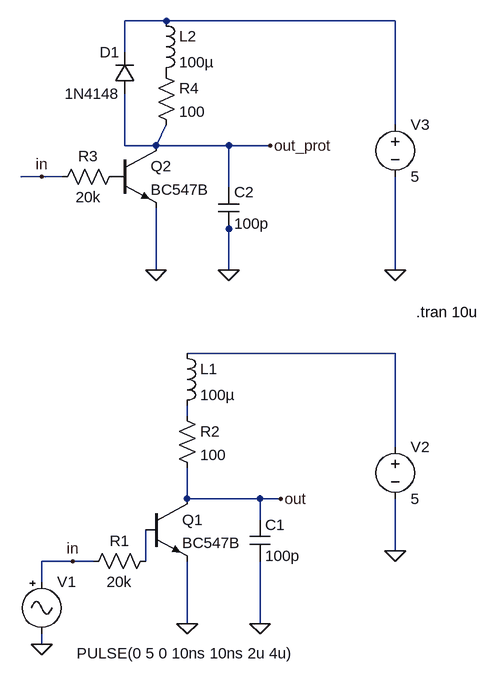
[diagram p0: schematic 3.10.asc]
3.10.asc, the LTspice schematic file:
Version 4
SHEET 1 880 1112
WIRE -128 -32 -192 -32
WIRE 224 -32 -128 -32
WIRE -192 16 -192 -32
WIRE 224 128 224 -32
WIRE -192 160 -192 80
WIRE -144 160 -128 128
WIRE -144 160 -192 160
WIRE -32 160 -144 160
WIRE 32 160 -32 160
WIRE -320 208 -352 208
WIRE -288 208 -320 208
WIRE -32 224 -32 160
WIRE -32 288 -32 272
WIRE -144 352 -144 256
WIRE -128 352 -144 352
WIRE -32 352 -32 288
WIRE 224 352 224 208
WIRE 224 480 -96 480
WIRE -96 576 -96 560
WIRE 224 624 224 480
WIRE -96 704 -96 656
WIRE 16 704 -96 704
WIRE 48 704 16 704
WIRE 16 736 16 704
WIRE 224 784 224 704
WIRE -272 800 -320 800
WIRE -240 800 -272 800
WIRE -160 800 -160 752
WIRE -320 832 -320 800
WIRE -96 896 -96 800
WIRE 16 896 16 800
WIRE -320 928 -320 912
FLAG -144 352 0
FLAG -32 352 0
FLAG 224 352 0
FLAG -320 208 in
FLAG 32 160 out_prot
FLAG -320 928 0
FLAG -96 896 0
FLAG 16 896 0
FLAG 224 784 0
FLAG -272 800 in
FLAG 48 704 out
SYMBOL res -192 192 R90
WINDOW 0 0 56 VBottom 2
WINDOW 3 32 56 VTop 2
SYMATTR InstName R3
SYMATTR Value 20k
SYMBOL res -144 32 R0
SYMATTR InstName R4
SYMATTR Value 100
SYMBOL voltage 224 112 R0
WINDOW 123 0 0 Left 2
WINDOW 39 0 0 Left 2
SYMATTR InstName V3
SYMATTR Value 5
SYMBOL cap -48 224 R0
SYMATTR InstName C2
SYMATTR Value 100p
SYMBOL npn -208 160 R0
SYMATTR InstName Q2
SYMATTR Value BC547B
SYMBOL ind -144 -48 R0
SYMATTR InstName L2
SYMATTR Value 100µ
SYMBOL diode -176 80 R180
WINDOW 0 24 64 Left 2
WINDOW 3 24 0 Left 2
SYMATTR InstName D1
SYMATTR Value 1N4148
SYMBOL Misc\\signal -320 816 R0
WINDOW 123 0 0 Left 2
WINDOW 39 0 0 Left 2
WINDOW 3 54 126 Left 2
SYMATTR InstName V1
SYMATTR Value PULSE(0 5 0 10ns 10ns 2u 4u)
SYMBOL res -144 784 R90
WINDOW 0 0 56 VBottom 2
WINDOW 3 32 56 VTop 2
SYMATTR InstName R1
SYMATTR Value 20k
SYMBOL res -112 560 R0
SYMATTR InstName R2
SYMATTR Value 100
SYMBOL voltage 224 608 R0
WINDOW 123 0 0 Left 2
WINDOW 39 0 0 Left 2
SYMATTR InstName V2
SYMATTR Value 5
SYMBOL cap 0 736 R0
SYMATTR InstName C1
SYMATTR Value 100p
SYMBOL npn -160 704 R0
SYMATTR InstName Q1
SYMATTR Value BC547B
SYMBOL ind -112 464 R0
SYMATTR InstName L1
SYMATTR Value 100µ
TEXT 256 416 Left 2 !.tran 10u

The netlist it stands for:
* 3.10.asc
R3 P001 in 20k
R4 P002 out_prot 100
V3 N001 0 5
C2 out_prot 0 100p
Q2 out_prot P001 0 0 BC547B
L2 N001 P002 100µ
D1 out_prot N001 1N4148
V1 in 0 PULSE(0 5 0 10ns 10ns 2u 4u)
R1 N004 in 20k
R2 N003 out 100
V2 N002 0 5
C1 out 0 100p
Q1 out N004 0 0 BC547B
L1 N002 N003 100µ
.model D D
.lib standard.dio
.model NPN NPN
.model PNP PNP
.lib standard.bjt
.tran 10u
.backanno
.end